# EAGLE design SystemControl (EAGLE 7.5.0)
CNAME: Homebrew SystemControl; CREVISION: 1.15; DESIGNER: Simon Hu
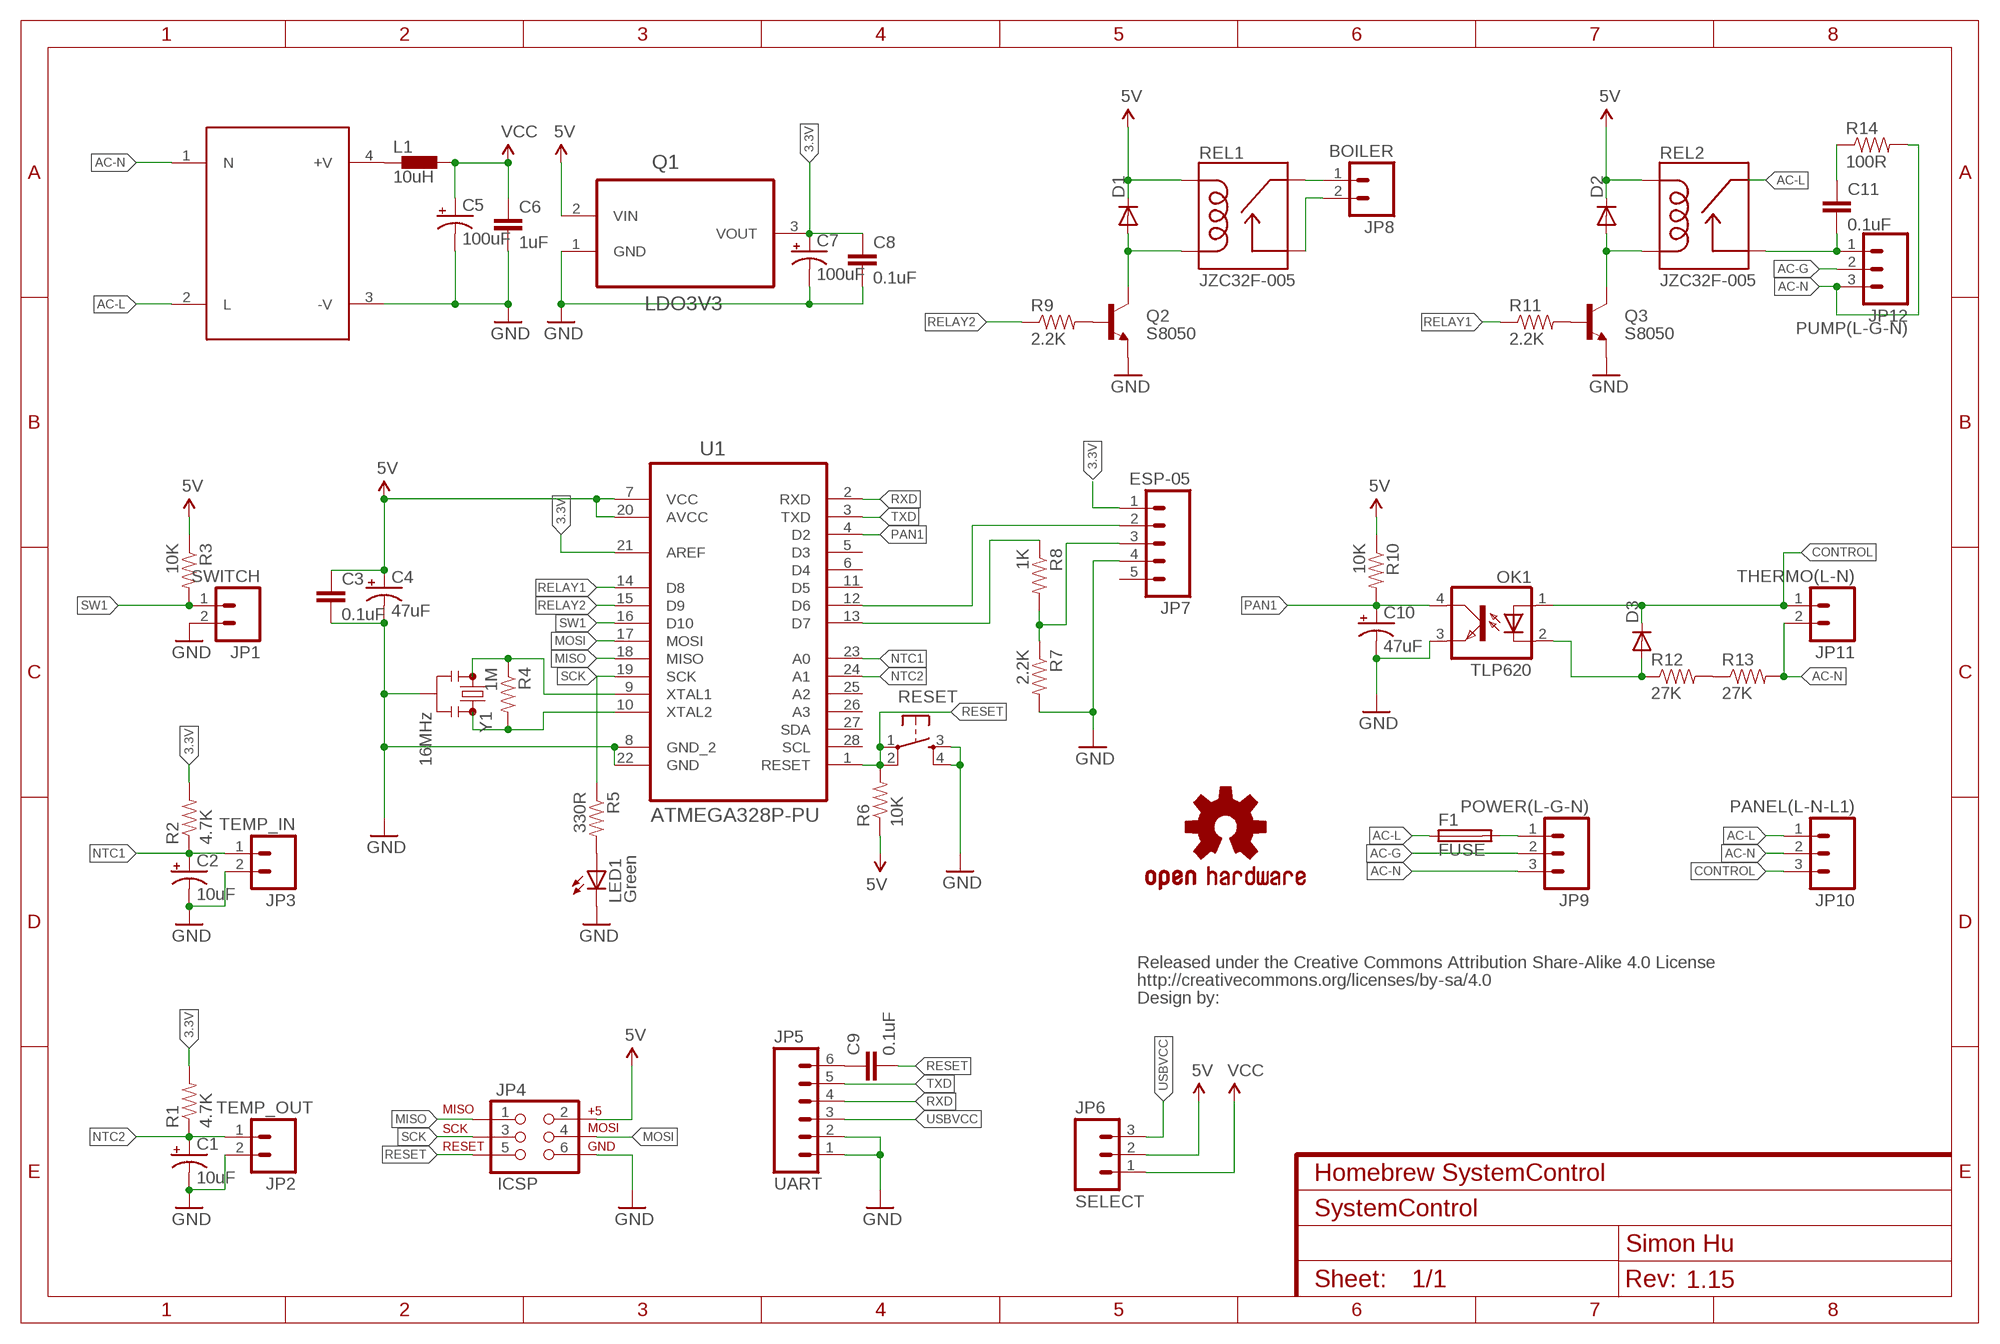
[diagram p0: schematic, sheet 1]

## Parts
C1  10uF  CAP_POLPTH2  [CPOL-RADIAL-10UF-25V]
C2  10uF  CAP_POLPTH2  [CPOL-RADIAL-10UF-25V]
C3  0.1uF  CAPPTH2  [CAP-PTH-SMALL2]
C4  47uF  CAP_POLPTH2  [CPOL-RADIAL-10UF-25V]
C5  100uF  CAP_POLPTH2  [CPOL-RADIAL-10UF-25V]
C6  1uF  CAPPTH2  [CAP-PTH-SMALL2]
C7  100uF  CAP_POLPTH2  [CPOL-RADIAL-10UF-25V]
C8  0.1uF  CAPPTH2  [CAP-PTH-SMALL2]
C9  0.1uF  CAPPTH2  [CAP-PTH-SMALL2]
C10  47uF  CAP_POLPTH2  [CPOL-RADIAL-10UF-25V]
C11  0.1uF  CAPPTH3  [CAP-PTH-LARGE]
CC_TEXT1  CREATIVE_COMMONS  [CREATIVE_COMMONS]
D1  1N4007  DIODEDO-1N4148  [DO-1N4148]
D2  1N4007  DIODEDO-1N4148  [DO-1N4148]
D3  1N4007  DIODEDO-1N4148  [DO-1N4148]
F1  FUSE  FUSESHK20L  [SHK20L]
IC1  NI-BOXING  [NI-BOXING]
JP1  SWITCH  M02LOCK  [1X02_LOCK]
JP2  TEMP_OUT  M02LOCK  [1X02_LOCK]
JP3  TEMP_IN  M02LOCK  [1X02_LOCK]
JP4  ICSP  AVR_SPI_PRG_6PTH  [2X3]
JP5  UART  M06LOCK  [1X06_LOCK]
JP6  SELECT  M03LOCK  [1X03_LOCK]
JP7  ESP-05  M05LOCK  [1X05_LOCK]
JP8  BOILER  M025MM  [SCREWTERMINAL-5MM-2]
JP9  POWER(L-G-N)  M03-SCREW-5MM  [SCREWTERMINAL-5MM-3]
JP10  PANEL(L-N-L1)  M03-SCREW-5MM  [SCREWTERMINAL-5MM-3]
JP11  THERMO(L-N)  M025MM  [SCREWTERMINAL-5MM-2]
JP12  PUMP(L-G-N)  M03-SCREW-5MM  [SCREWTERMINAL-5MM-3]
L1  10uH  BL01RN1A  [BL01RN1A]
LED1  Green  LED3MM  [LED3MM]
LOGO1  OSHW-LOGOL  [OSHW-LOGO-L]
OK1  TLP620  PC817  [DIL04]
Q1  LDO3V3  MCP1702-3302E/TO  [TO127P254X533-3]
Q2  S8050  TRANSISTOR_NPN2N3904  [TO-92]
Q3  S8050  TRANSISTOR_NPN2N3904  [TO-92]
R1  4.7K  RESISTORPTH-1/4W  [AXIAL-0.4]
R2  4.7K  RESISTORPTH-1/4W  [AXIAL-0.4]
R3  10K  RESISTORPTH-1/4W  [AXIAL-0.4]
R4  1M  RESISTORPTH-1/4W  [AXIAL-0.4]
R5  330R  RESISTORPTH-1/4W  [AXIAL-0.4]
R6  10K  RESISTORPTH-1/4W  [AXIAL-0.4]
R7  2.2K  RESISTORPTH-1/4W  [AXIAL-0.4]
R8  1K  RESISTORPTH-1/4W  [AXIAL-0.4]
R9  2.2K  RESISTORPTH-1/4W  [AXIAL-0.4]
R10  10K  RESISTORPTH-1/4W  [AXIAL-0.4]
R11  2.2K  RESISTORPTH-1/4W  [AXIAL-0.4]
R12  27K  RESISTORPTH-1W  [AXIAL-0.6]
R13  27K  RESISTORPTH-1W  [AXIAL-0.6]
R14  100R  RESISTORPTH-1W  [AXIAL-0.6]
REL1  JZC32F-005  RELAYPTH4  [RELAY-JZC]
REL2  JZC32F-005  RELAYPTH4  [RELAY-JZC]
RESET  TAC_SWITCHPTH  [TACTILE-PTH]
U1  ATMEGA328P-PU  [DIP254P762X457-28]
Y1  16MHz  RESONATORPTH  [RESONATOR-PTH]

## Nets
3.3V [POWER]: C7.1(+) C8.1 JP7.1 Q1.3(VOUT) R1.P$2 R2.P$2 U1.21(AREF)
5V [POWER]: C3.1 C4.1(+) D1.C D2.C JP4.2(VCC) JP6.2 Q1.2(VIN) R3.P$1 R6.P$1 R10.P$1 REL1.5(COIL1) REL2.5(COIL1) U1.7(VCC) U1.20(AVCC)
AC-G [AC]: JP9.2 JP12.2
AC-L [AC]: F1.1A IC1.2(L) JP10.1 REL2.4(MAIN)
AC-N [AC]: IC1.1(N) JP9.3 JP10.2 JP11.2 JP12.3 R13.P$2 R14.P$2
CONTROL [THERMO]: D3.C JP10.3 JP11.1 OK1.1(A)
GND [POWER]: C1.2(-) C2.2(-) C3.2 C4.2(-) C5.2(-) C6.2 C7.2(-) C8.2 C10.2(-) IC1.3(-V) JP1.2 JP2.2 JP3.2 JP4.6(GND) JP5.1(GND) JP5.2(EMPTY) JP7.4 LED1.K(C) OK1.3(EMIT) Q1.1(GND) Q2.1(E) Q3.1(E) R7.P$2 RESET.3 RESET.4 U1.8(GND_2) U1.22(GND) Y1.2
MISO: JP4.1(MISO) U1.18(MISO)
MOSI: JP4.4(MOSI) U1.17(MOSI)
N$1: C9.1 JP5.6(RESET)
N$2: R4.P$1 U1.9(XTAL1) Y1.1
N$3: R4.P$2 U1.10(XTAL2) Y1.3
N$4: Q3.2(B) R11.P$2
N$5: D2.A Q3.3(C) REL2.1(COIL2)
N$6: Q2.2(B) R9.P$2
N$7: D1.A Q2.3(C) REL1.1(COIL2)
N$8 [POWER]: JP8.1 REL1.4(MAIN)
N$9 [POWER]: JP8.2 REL1.3(NO)
N$10: LED1.A R5.P$2
N$11 [AC]: C11.2 JP12.1 REL2.3(NO)
N$12 [POWER]: IC1.4(+V) L1.1
N$13 [AC]: C11.1 R14.P$1
N$14: JP7.3 R7.P$1 R8.P$2
N$15 [AC]: F1.2A JP9.1
N$16 [THERMO]: R12.P$2 R13.P$1
N$17 [THERMO]: D3.A OK1.2(C) R12.P$1
N$18: JP7.2 U1.12(D6)
N$19: R8.P$1 U1.13(D7)
NTC1: C2.1(+) JP3.1 R2.P$1 U1.23(A0)
NTC2: C1.1(+) JP2.1 R1.P$1 U1.24(A1)
PAN1: C10.1(+) OK1.4(COL) R10.P$2 U1.4(D2)
RELAY1: R11.P$1 U1.14(D8)
RELAY2: R9.P$1 U1.15(D9)
RESET: C9.2 JP4.5(RESET) R6.P$2 RESET.1 RESET.2 U1.1(RESET)
RXD: JP5.4(RXD) U1.2(RXD)
SCK: JP4.3(SCK) R5.P$1 U1.19(SCK)
SW1: JP1.1 R3.P$2 U1.16(D10)
TXD: JP5.5(TXD) U1.3(TXD)
USBVCC [POWER]: JP5.3(VCC) JP6.3
VCC [POWER]: C5.1(+) C6.1 JP6.1 L1.2
Unconnected: JP7.5 U1.5(D3) U1.6(D4) U1.11(D5) U1.25(A2) U1.26(A3) U1.27(SDA) U1.28(SCL)

## Library data of the parts
C1 C2 C4 C5 C7 C10 = SparkFun-Capacitors:CAP_POL: Capacitor Polarized These are standard SMD and PTH capacitors. Normally 10uF, 47uF, and 100uF in electrolytic and tantalum varieties. Always verify the external diameter of the through hole cap, it varies with capacity, voltage, and manufacturer. The EIA devices should be standard.
C3 C6 C8 C9 = SparkFun-Capacitors:CAP: Capacitor Standard 0603 ceramic capacitor, and 0.1" leaded capacitor.
C11 = SparkFun-Passives:CAP: Capacitor Standard 0603 ceramic capacitor, and 0.1" leaded capacitor.
CC_TEXT1 = SparkFun-Retired:CREATIVE_COMMONS: Creative Commons License summary- RETIRED. Please use parts FRAME-LETTER/FRAME-LEDGER to add this to both schematic and board file.
D1-D3 = adafruit:DIODE: Diode SMADIODE - SMA Surface Mount Package 20V 1A Schottky Diode Digikey: 641-1014-6-ND DO-1N4148 - Through Hole Small Current Diode SOD-123 20V 1 A (.5mV Vf) Schottky Diode - Digikey: MBRX120TPMSCT-ND SOD-323 10V 570mA (.38mV Vf, 3ns) Schottky Diode - Digikey: ZLLS410CT-ND SOD-523 30V 30mA Schottky Diode (RB751S-40TE61) - Digikey: RB751S-40TE61CT-ND SOT23-R/W - SOT23 Package (R = Solder Paste/Reflow Ovens, W = Hand-Soldering) BAT54Film 40V 300mA - Digikey: 497-7162-1-ND
F1 = fuse:FUSE: Fuse; OC_FARNELL: unknown; OC_NEWARK: unknown
IC1 = Airfit:NI-BOXING: NI-BOXING POWER SUPLY
JP1-JP3 = SparkFun-Connectors:M02: Standard 2-pin 0.1" header. Use with - straight break away headers ( PRT-00116) - right angle break away headers (PRT-00553) - swiss pins (PRT-00743) - machine pins (PRT-00117) - female headers (PRT-00115) Molex polarized connector foot print use with: PRT-08233 with associated crimp pins and housings. 2.54_SCREWTERM for use with PRT-10571. 3.5mm Screw Terminal footprints for PRT-08084 5mm Screw Terminal footprints for use with PRT-08432
JP4 = SparkFun-Connectors:AVR_SPI_PRG_6: AVR ISP 6 Pin This is the reduced ISP connector for AVR programming. Common on Arduino. This footprint will take up less PCB space and can be used with a 10-pin to 6-pin adapter such as SKU: BOB-08508 **Special note about "TEST_POINT" package. The stop mask is on the top side, so if you want your programming test points to be on the bottom of your board, make sure to place this package on the bottom side of the board. This also ensure that the orientation to program from the bottom side will be correct.
JP5 = SparkFun-Connectors:M06: Header 6 Standard 6-pin 0.1" header. Use with straight break away headers (SKU : PRT-00116), right angle break away headers (PRT-00553), swiss pins (PRT-00743), machine pins (PRT-00117), and female headers (PRT-00115). Molex polarized connector foot print use with SKU : PRT-08094 with associated crimp pins and housings. NOTES ON THE VARIANTS LOCK and LOCK_LONGPADS... This footprint was designed to help hold the alignment of a through-hole component (i.e. 6-pin header) while soldering it into place. You may notice that each hole has been shifted either up or down by 0.005 of an inch from it's more standard position (which is a perfectly straight line). This slight alteration caused the pins (the squares in the middle) to touch the edges of the holes. Because they are alternating, it causes a "brace" to hold the component in place. 0.005 has proven to be the perfect amount of "off-center" position when using our standard breakaway headers. Although looks a little odd when you look at the bare footprint, once you have a header in there, the alteration is very hard to notice. Also,if you push a header all the way into place, it is covered up entirely on the bottom side. This idea of altering the position of holes to aid alignment will be further integrated into the Sparkfun Library for other footprints. It can help hold any component with 3 or more connection pins.
JP6 = SparkFun-Connectors:M03: Header 3 Standard 3-pin 0.1" header. Use with straight break away headers (SKU : PRT-00116), right angle break away headers (PRT-00553), swiss pins (PRT-00743), machine pins (PRT-00117), and female headers (PRT-00115). Molex polarized connector foot print use with SKU : PRT-08232 with associated crimp pins and housings.
JP7 = SparkFun-Connectors:M05: Header 5 Standard 5-pin 0.1" header. Use with straight break away headers (SKU : PRT-00116), right angle break away headers (PRT-00553), swiss pins (PRT-00743), machine pins (PRT-00117), and female headers (PRT-00115). Molex polarized connector foot print use with SKU : PRT-08230 with associated crimp pins and housings.
JP8 JP11 = SparkFun-Connectors:M02: Standard 2-pin 0.1" header. Use with - straight break away headers ( PRT-00116) - right angle break away headers (PRT-00553) - swiss pins (PRT-00743) - machine pins (PRT-00117) - female headers (PRT-00115) Molex polarized connector foot print use with: PRT-08233 with associated crimp pins and housings. 2.54_SCREWTERM for use with PRT-10571. 3.5mm Screw Terminal footprints for PRT-08084 5mm Screw Terminal footprints for use with PRT-08432; STOREFRONT_ID: PRT-08432
JP9 JP10 JP12 = SparkFun-Connectors:M03: Header 3 Standard 3-pin 0.1" header. Use with straight break away headers (SKU : PRT-00116), right angle break away headers (PRT-00553), swiss pins (PRT-00743), machine pins (PRT-00117), and female headers (PRT-00115). Molex polarized connector foot print use with SKU : PRT-08232 with associated crimp pins and housings.; STOREFRONT_ID: PRT-08433
L1 = inductors:BL0: Noise Suppression Products/EMI Suppression Filters, Lead EMIFIL(R) Inductor Type Source: http://www.murata.com .. BL01RN1_DS.pdf
LED1 = adafruit:LED: LED OSRAM: - CHIPLED LG R971, LG N971, LY N971, LG Q971, LY Q971, LO R971, LY R971 LH N974, LH R974 LS Q976, LO Q976, LY Q976 LO Q996 - Hyper CHIPLED LW Q18S LB Q993, LB Q99A, LB R99A - SideLED LS A670, LO A670, LY A670, LG A670, LP A670 LB A673, LV A673, LT A673, LW A673 LH A674 LY A675 LS A676, LA A676, LO A676, LY A676, LW A676 LS A679, LY A679, LG A679 - Hyper Micro SIDELED® LS Y876, LA Y876, LO Y876, LY Y876 LT Y87S - SmartLED LW L88C, LW L88S LB L89C, LB L89S, LG L890 LS L89K, LO L89K, LY L89K LS L896, LA L896, LO L896, LY L896 - TOPLED LS T670, LO T670, LY T670, LG T670, LP T670 LSG T670, LSP T670, LSY T670, LOP T670, LYG T670 LG T671, LOG T671, LSG T671 LB T673, LV T673, LT T673, LW T673 LH T674 LS T676, LA T676, LO T676, LY T676, LB T676, LH T676, LSB T676, LW T676 LB T67C, LV T67C, LT T67C, LS T67K, LO T67K, LY T67K, LW E67C LS E67B, LA E67B, LO E67B, LY E67B, LB E67C, LV E67C, LT E67C LW T67C LS T679, LY T679, LG T679 LS T770, LO T770, LY T770, LG T770, LP T770 LB T773, LV T773, LT T773, LW T773 LH T774 LS E675, LA E675, LY E675, LS T675 LS T776, LA T776, LO T776, LY T776, LB T776 LHGB T686 LT T68C, LB T68C - Hyper Mini TOPLED® LB M676 - Mini TOPLED Santana® LG M470 LS M47K, LO M47K, LY M47K Source: http://www.osram.convergy.de/
LOGO1 = SparkFun-Aesthetics:OSHW-LOGO: Open Source Hardware Logo This logo indicates the piece of hardware it is found on incorporates a OSHW license and/or adheres to the definition of open source hardware found here: http://freedomdefined.org/OSHW
OK1 = optocoupler:PC817: SHARP OPTO COUPLER; MPN: PC817X4J000F; OC_FARNELL: 9707727; OC_NEWARK: 97K7059
Q1 = Microchip_By_element14_Batch_1:MCP1702-3302E/TO: IC, V REG, LDO, 250MA; MPN: MCP1702-3302E/TO; OC_FARNELL: 1331485; OC_NEWARK: 34M7419; PACKAGE: TO-92; SUPPLIER: Microchip
Q2 Q3 = SparkFun-DiscreteSemi:TRANSISTOR_NPN: Generic NPN BJT MMBT2222A - TRANS-08049 (SOT-23, 1A 40V) MPSA42 - TRANS-09116 (SOT-23, 500mA 300V) MMBT5088LT1G - TRANS-11160 (SOT-23, 50 mA 30V) BC547 - COM-08928 <http://www.sparkfun.com/products/8928> (TO-92 45V 100mA) (1.Collector 2.Base 3.Emitter) 2N3904 - COM-00521 <http://www.sparkfun.com/products/521> (TO-92 40V 200mA) (1.Emitter 2.Base 3.Collector) P2N2222A - COM-12852 <http://www.sparkfun.com/products/12852> (TO-92 40V 600mA) (1.Collector 2.Base 3.Emitter); PROD_ID: TRANS-08447
R1-R11 = SparkFun-Passives:RESISTOR: Resistor Basic schematic elements and footprints for 0603, 1206, and PTH resistors.
R12-R14 = SparkFun-Resistors:RESISTOR: Resistor Basic schematic elements and footprints for 0603, 1206, and PTH resistors.
REL1 REL2 = Airfit:RELAY: SPDT relay (COM-00101)
RESET = SparkFun-Retired:TAC_SWITCH: Momentary Switch Button commonly used for reset or general input. Spark Fun Electronics SKU : COM-00097 SMT- SWCH-08247
U1 = Atmel_By_element14_Batch_1-00:ATMEGA328P-PU: 8-bit Microcontroller with In-System Programmable Flash; MPN: ATMEGA328P-PU; OC_FARNELL: 1715487; OC_NEWARK: 15R0268; PACKAGE: PDIP-28; SUPPLIER: Atmel
Y1 = SparkFun-FreqCtrl:RESONATOR: Resonator Small SMD resonator. Used, eg, on the Arduino Pro/ Pro Mini boards. 8MHz- XTAL-08895 16MHz- XTAL-08900

## Net classes
1 AC: width 2.032 mm, clearance 2.54 mm
2 THERMO: width 1.27 mm, clearance 1.27 mm
3 POWER: width 0.61 mm, clearance 0.406 mm

## Board
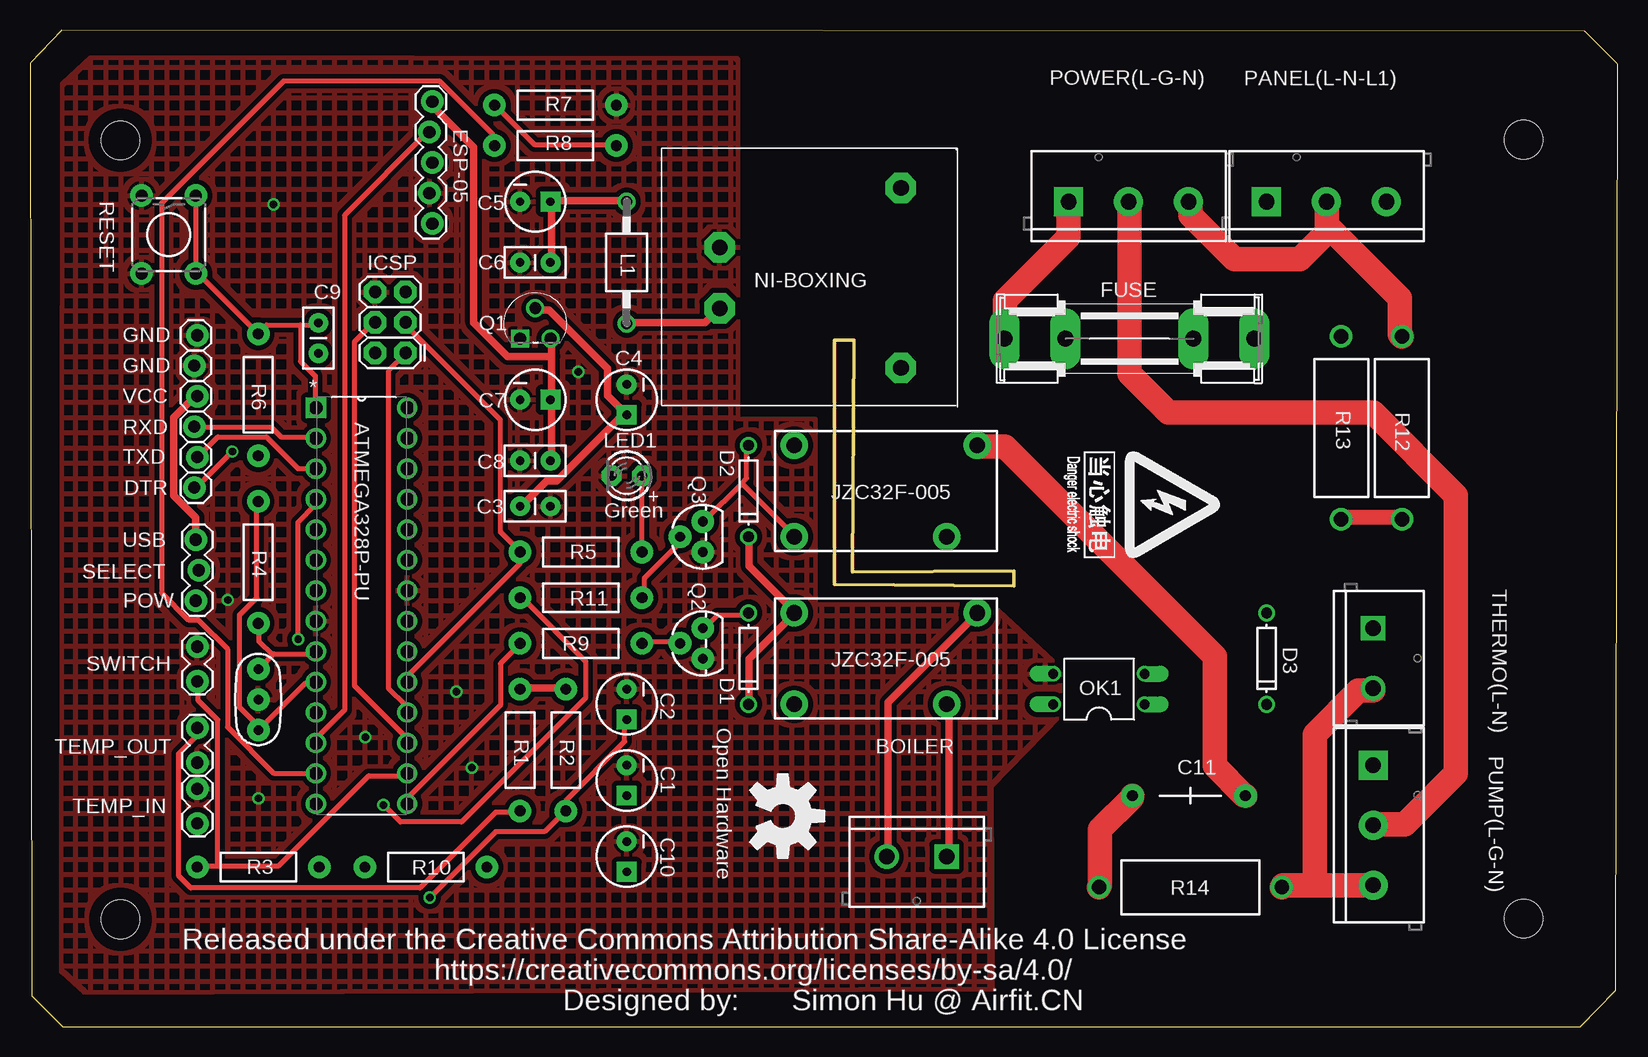
[diagram p1: board, top side]
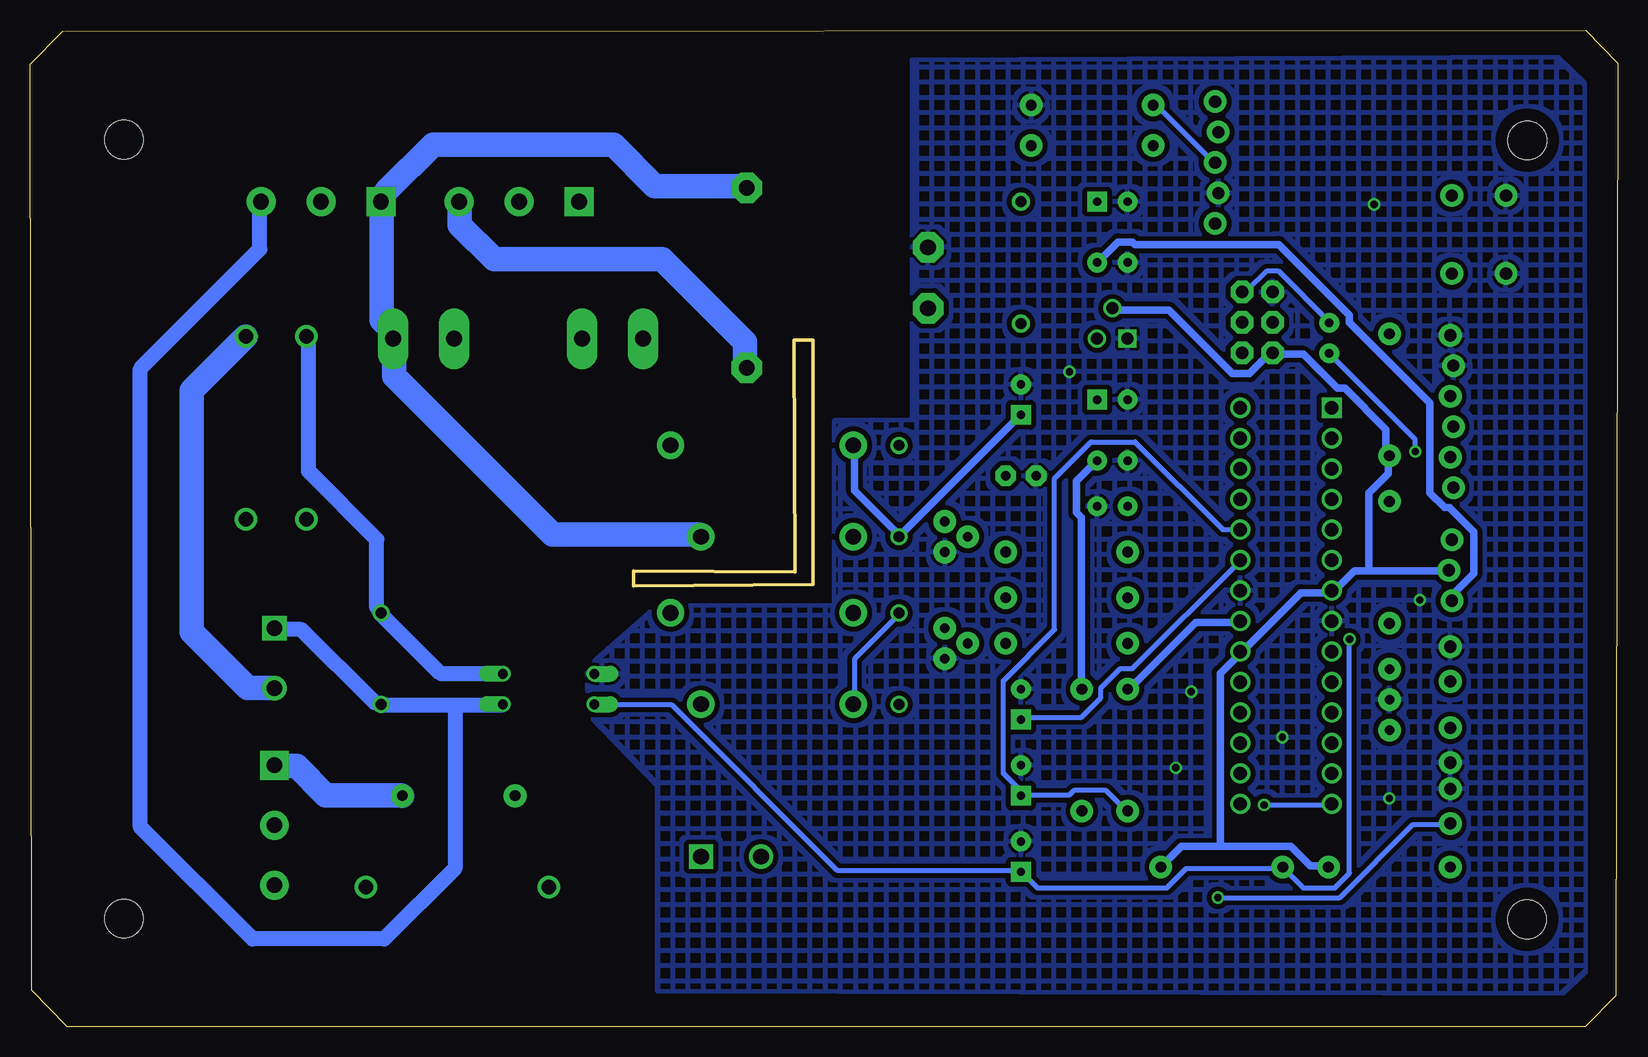
[diagram p2: board, bottom side, seen from below]

Size 132.34 x 83.1 mm. Coordinates in mm from the lower left corner, seen from the top.
Outline: 2.71,0 129.25,0 132.19,3.05 132.34,80.25 129.61,83 2.64,83.1 0,80.33 0.14,2.57 2.71,0
Copper layers (1*16): Top 0.035mm / dielectric 1.5mm / Bottom 0.035mm
Design rules "default *": minimum track width 16mil, minimum drill 24mil, track to track 16mil, track to pad 16mil, pad to pad 16mil, via to via 16mil, smd to smd 16mil, copper to edge 40mil, drill to drill 8mil, minimum pad ring 10mil, minimum via ring 8mil, stop-mask expansion 4mil, vias tented up to drill 0mil, thermal gap 10mil
Holes 3.2 mm at 7.53,73.91 7.55,8.96 124.51,73.95 124.51,9.02
Milling: area 67.1,36.7 to 82,57.3

### Footprints (pad centres in the part's own frame; a part is rotated, then mirrored left to right if it is on the bottom)
CPOL-RADIAL-10UF-25V = drill 0.7 pad 1.651 square: 1 1.27,0 | drill 0.7 pad 1.651: 2 -1.27,0
CAP-PTH-SMALL2 = drill 0.7 pad 1.651: 1 0,0; 2 2.54,0
CAP-PTH-LARGE = drill 0.9 pad 1.905: 1 -4.826,0; 2 4.572,0
DO-1N4148 = drill 0.9: A -3.81,0; C 3.81,0
SHK20L = drill 1.321 pad 2.54 long: 1A -10.414,0; 1B -5.334,0; 2A 10.414,0; 2B 5.334,0
NI-BOXING = drill 1.3 pad 2.54 octagon: 1 -7.62,7.493; 2 -7.62,-7.493; 3 7.493,-2.54; 4 7.493,2.54
1X02_LOCK = drill 1.016 pad 1.88: 1 -0.178,0; 2 2.718,0
2X3 = drill 1.016 pad 1.88 octagon: 1 0,0; 2 0,2.54; 3 2.54,0; 4 2.54,2.54; 5 5.08,0; 6 5.08,2.54
1X06_LOCK = drill 1.016 pad 1.88: 1 0,0; 2 2.54,-0.254; 3 5.08,0; 4 7.62,-0.254; 5 10.16,0; 6 12.7,-0.254
1X03_LOCK = drill 1.016 pad 1.88: 1 0,0.127; 2 2.54,-0.127; 3 5.08,0.127
1X05_LOCK = drill 1.016 pad 1.88: 1 0,0.127; 2 2.54,-0.127; 3 5.08,0.127; 4 7.62,-0.127; 5 10.16,0.127
SCREWTERMINAL-5MM-2 = drill 1.3 pad 2.032 square: 1 0,0 | drill 1.3 pad 2.032: 2 5,0
SCREWTERMINAL-5MM-3 = drill 1.3 pad 2.413 square: 1 0,0 | drill 1.3 pad 2.413: 2 5,0; 3 10,0
BL01RN1A = drill 0.9 pad 1.5: 1 -5.08,0; 2 5.08,0
LED3MM = drill 0.813 pad 1.676 octagon: A -1.27,0; K 1.27,0
DIL04 = drill 0.813 offset: 1 -1.27,-3.81; 2 1.27,-3.81; 3 1.27,3.81; 4 -1.27,3.81
TO127P254X533-3 = drill 0.991 square: 1 -2.54,-2.54 | drill 0.991: 2 -1.27,0; 3 0,-2.54
TO-92 = drill 0.813 pad 1.88: 1 -1.27,0; 2 0,1.905; 3 1.27,0
AXIAL-0.4 = drill 0.9 pad 1.88: P$1 -5.08,0; P$2 5.08,0
AXIAL-0.6 = drill 1.2 pad 1.88: P$1 -7.62,0; P$2 7.62,0
RELAY-JZC = drill 1.3 pad 2.286: 1 3.81,-8.89; 3 -3.81,6.35; 4 3.81,3.81; 5 -3.81,-8.89
TACTILE-PTH = drill 1.016 pad 1.88: 1 -3.251,2.261; 2 3.251,2.261; 3 -3.251,-2.261; 4 3.251,-2.261
DIP254P762X457-28 = drill 1.118 square: 1 -7.62,33.02 | drill 1.118: 2 -7.62,30.48; 3 -7.62,27.94; 4 -7.62,25.4; 5 -7.62,22.86; 6 -7.62,20.32; 7 -7.62,17.78; 8 -7.62,15.24; 9 -7.62,12.7; 10 -7.62,10.16; 11 -7.62,7.62; 12 -7.62,5.08; 13 -7.62,2.54; 14 -7.62,0; 15 0,0; 16 0,2.54; 17 0,5.08; 18 0,7.62; 19 0,10.16; 20 0,12.7; 21 0,15.24; 22 0,17.78; 23 0,20.32; 24 0,22.86; 25 0,25.4; 26 0,27.94; 27 0,30.48; 28 0,33.02
RESONATOR-PTH = drill 0.8 pad 1.88: 1 -2.54,0; 2 0,0; 3 2.54,0

### Placement (x,y rotation side)
C1  49.74,20.53 270 top
C2  49.74,26.88 270 top
C3  40.85,43.39 0 top
C4  49.74,52.28 270 top
C5  42.12,68.79 0 top
C6  43.39,63.71 180 top
C7  42.12,52.28 0 top
C8  43.39,47.2 180 top
C9  24.04,56.14 90 top
C10  49.74,14.18 270 top
C11  96.73,19.26 0 top
CC_TEXT1  32.98,1.35 0 top
D1  59.9,30.69 270 top
D2  59.9,44.66 270 top
D3  103.08,30.69 270 top
F1  91.65,57.36 180 top
IC1  64.98,62.44 180 top
JP1  13.95,28.97 90 top
JP2  13.95,24.74 270 top
JP3  13.95,17.12 90 top
JP4  31.31,56.18 90 top
JP5  13.95,57.65 270 top
JP6  13.95,35.52 90 top
JP7  33.42,77.13 270 top
JP8  76.41,14.18 180 top
JP9  86.57,68.79 0 top
JP10  103.08,68.79 0 top
JP11  111.97,33.23 270 top
JP12  111.97,21.8 270 top
L1  49.74,63.71 90 top
LED1  49.74,45.93 180 top
LOGO1  62.76,17.57 270 top
OK1  89.11,28.15 90 top
Q1  43.39,59.9 0 top
Q2  56.09,31.96 90 top
Q3  56.09,40.85 90 top
R1  40.85,23.07 90 top
R2  44.66,23.07 90 top
R3  19.03,13.31 180 top
R4  19.03,38.71 90 top
R5  45.93,39.58 0 top
R6  19.03,52.68 90 top
R7  43.8,76.84 0 top
R8  43.8,73.47 0 top
R9  45.93,31.96 0 top
R10  33,13.31 180 top
R11  45.93,35.77 0 top
R12  109.29,49.93 270 top
R13  114.36,49.93 90 top
R14  96.73,11.64 0 top
REL1  72.6,30.69 270 top
REL2  72.6,44.66 270 top
RESET  11.56,66.05 270 top
U1  31.45,18.58 0 top
Y1  19.03,27.28 270 top

### Tracks (layer width: path | path; a pad name or v marks a point on that pad's centre or on a via)
3.3V
  Top 0.61: R2.P$2 44.5,28.24 41.05,28.24 R1.P$2 | 43.48,55.88 43.48,52.42 C7.1 43.48,52.02 43.48,47.34 C8.1 | 43.48,55.88 43.48,57.3 Q1.3 | 43.48,55.88 39.83,55.88 36.98,58.72 36.98,73.35 33.73,76.6 33.73,77.01 JP7.1
  Bottom 0.61: U1.21 31.5,33.73 35.15,33.73 40.84,28.04 R1.P$2 | R2.P$2 44.7,28.24 44.7,42.47 45.11,42.87 45.11,45.51 43.48,47.14 C8.1
5V
  Top 0.61: Q1.2 42.27,59.74 43.28,59.74 48.16,54.86 48.16,52.63 49.58,51.2 C4.1 49.38,51 43.89,45.51 43.08,45.51 41.05,43.48 C3.1 | D1.C 59.94,27.02 59.94,30.68 63.6,34.34 REL1.5 63.6,34.74 59.94,38.4 59.94,40.84 D2.C
  Bottom 0.61: REL2.5 63.6,48.36 63.6,44.7 59.94,41.04 D2.C 59.74,41.04 49.78,51 C4.1 | 33.12,15.03 36.37,15.03 38,13.41 R10.P$1 | 33.12,15.03 27.23,15.03 25.6,13.41 24.18,13.41 R3.P$1 | 20.73,38 21.95,38 23.57,36.37 U1.7 23.98,36.17 26.42,36.17 31.29,31.29 U1.20 31.5,31.09 33.12,29.46 33.12,15.03 | 20.73,38 14.22,38 JP6.2 | 20.73,38 20.73,44.5 19.1,46.12 19.1,47.55 R6.P$1 19.3,47.75 19.3,49.78 22.76,53.24 23.37,53.24 26.21,56.08 28.65,56.08 JP4.2 29.06,56.08 30.68,54.46 32.11,54.46 37.39,59.74 42.06,59.74 Q1.2
AC-G
  Top 2.032: JP12.2 112.17,16.86 114.61,16.86 118.87,21.13 118.87,44.3 111.96,51.2 94.89,51.2 91.64,54.46 91.64,68.68 JP9.2
AC-L
  Bottom 2.032: REL2.4 76.61,41.04 88.8,41.04 102.01,54.25 102.01,57.3 F1.1A 102.41,58.32 103.02,58.93 103.02,68.68 JP10.1 102.62,69.7 98.75,73.56 83.72,73.56 80.26,70.1 72.75,70.1 IC1.2
AC-N
  Top 2.032: 107.09,11.78 111.96,11.78 JP12.3 | 107.09,11.78 104.44,11.78 R14.P$2 | 107.09,11.78 107.09,24.38 110.74,28.04 111.96,28.04 JP11.2 | 108.41,66.55 108.1,66.85 108.1,68.68 JP10.2 | 108.41,66.55 114.2,60.75 114.2,57.71 R13.P$2 | 108.41,66.55 105.87,64.01 100.38,64.01 96.72,67.66 96.72,68.68 JP9.3
  Bottom 2.032: IC1.1 72.75,55.06 72.75,57.1 79.65,64.01 93.67,64.01 96.52,66.85 96.52,68.68 JP9.3 | JP11.2 112.17,28.24 114.2,28.24 118.87,32.92 118.87,53.03 114.4,57.5 R13.P$2
CONTROL
  Bottom 1.27: 96.93,26.82 103.02,26.82 D3.C 103.63,27.02 109.73,33.12 111.96,33.12 JP11.1 | 96.93,26.82 93.07,26.82 OK1.1 | 96.93,26.82 96.93,13.21 102.82,7.31 113.79,7.31 123.14,16.66 123.14,54.86 113.18,64.82 113.18,68.68 JP10.3
GND  (via drill 0.61)
  other vias: 20.3,68.56 19.03,19.05 35.54,27.93 36.84,21.59 45.7,54.6 27.95,24.14 16.49,35.58
  pour Bottom (hatched): 4.98,80.85 58.83,80.6 58.83,50.53 65.32,50.53 65.32,35.08 80.06,35.08 85.91,29.96 85.86,26.07 80.09,20.1 80.06,2.98 4.57,2.77 2.64,4.57 2.73,78.65
  pour Top (hatched): 5.04,80.83 58.96,80.74 58.96,50.67 65.46,50.67 65.46,35.22 80.19,35.22 85.82,30.02 85.82,25.92 80.09,20.04 80.19,3.12 4.56,2.83 2.64,4.57 2.73,78.65
MISO
  Top 0.406: U1.18 31.29,26.21 31.29,26.82 29.87,28.24 29.87,54.66 31.29,56.08 JP4.1
MOSI
  Top 0.406: U1.17 31.29,23.77 31.29,24.18 27.03,28.45 27.03,57.1 28.65,58.72 JP4.4
N$1  (via drill 0.61)
  Top 0.406: v16.87,47.95 13.82,44.9 JP5.6
  Bottom 0.406: v16.87,47.95 16.87,48.97 23.98,56.08 C9.1
N$2
  Top 0.406: 20.22,30.99 19.1,29.87 Y1.1 | 20.22,30.99 20.32,31.09 23.77,31.09 U1.9 | 20.22,30.99 19.1,32.1 19.1,33.53 R4.P$1
N$3
  Top 0.406: U1.10 23.77,28.65 22.96,28.65 19.1,24.79 Y1.3 19.1,24.99 17.48,26.62 17.48,34.34 18.9,35.76 18.9,43.69 R4.P$2
N$4
  Top 0.406: R11.P$2 51.21,35.96 51.21,37.39 54.05,40.23 54.05,40.84 Q3.2
N$5
  Top 0.406: 59.33,45.31 56.29,42.26 Q3.3 | 59.33,45.31 59.74,45.72 59.74,48.36 D2.A | 59.33,45.31 63.6,41.04 REL2.1
N$6
  Top 0.406: R9.P$2 51.21,32.1 54.05,32.1 Q2.2
N$7
  Top 0.406: D1.A 59.74,34.34 57.3,34.34 56.29,33.32 Q2.3
  Bottom 0.406: REL1.1 63.6,27.02 63.6,30.68 59.94,34.34 D1.A
N$8
  Top 0.61: JP8.1 76.61,14.22 76.61,26.82 REL1.4
N$9
  Top 0.61: JP8.2 71.53,14.22 71.53,27.02 78.84,34.34 REL1.3
N$10
  Top 0.406: LED1.A 51,45.92 51,39.62 R5.P$2
N$11
  Top 2.032: REL2.3 79.05,48.36 81.28,48.36 98.75,30.88 98.75,21.74 101.19,19.3 C11.2
  Bottom 2.032: C11.2 101.4,19.3 107.7,19.3 110.13,21.74 111.96,21.74 JP12.1
N$12
  Top 0.61: L1.1 49.78,58.72 56.29,58.72 57.3,59.74 IC1.4
N$13
  Top 2.032: R14.P$1 89.2,11.78 89.2,16.46 91.85,19.1 C11.1
N$14
  Top 0.406: R8.P$2 48.77,73.56 42.06,73.56 38.81,76.81 R7.P$1
  Bottom 0.406: JP7.3 33.73,72.13 38.61,77.01 R7.P$1
N$15
  Top 2.032: JP9.1 86.56,68.68 86.56,65.83 81.28,60.55 81.28,57.5 F1.2A
N$16
  Top 1.27: R12.P$2 109.32,42.47 114.2,42.47 R13.P$1
N$17
  Bottom 1.27: OK1.2 93.07,29.46 98.15,29.46 103.02,34.34 D3.A 103.43,34.95 103.43,40.64 109.12,46.33 109.12,57.5 R12.P$1
N$18
  Top 0.406: U1.12 23.98,23.77 23.98,24.18 26.21,26.41 26.21,67.66 33.12,74.57 JP7.2
N$19
  Top 0.406: U1.13 23.77,21.13 20.32,21.13 16.46,24.99 16.46,31.49 14.02,33.93 13.21,33.93 10.97,36.17 10.97,68.68 21.13,78.84 34.14,78.84 38.61,74.37 38.61,73.56 R8.P$1
NTC1  (via drill 0.61)
  Top 0.406: C2.1 49.58,25.6 49.58,23.77 44.7,18.9 44.7,18.08 R2.P$1 44.5,17.88 42.88,16.25 38.81,16.25 v33.33,10.77
  Bottom 0.406: U1.23 31.5,38.81 40.44,29.87 41.45,29.87 43.08,28.24 43.08,27.43 44.7,25.8 49.58,25.8 C2.1 | v33.33,10.77 23.16,10.77 17.07,16.86 14.02,16.86 JP3.1
NTC2
  Top 0.406: JP2.1 13.82,24.79 13.82,24.18 12.39,22.76 12.39,12.6 13.41,11.58 32.51,11.58 38.81,17.88 40.84,17.88 R1.P$1
  Bottom 0.406: R1.P$1 41.05,18.08 42.67,19.71 45.31,19.71 45.72,19.3 49.58,19.3 C1.1 49.58,19.5 51.21,21.13 51.21,28.85 46.94,33.12 46.94,45.72 43.89,48.77 40.23,48.77 32.92,41.45 31.5,41.45 U1.24
PAN1  (via drill 0.61)
  Top 0.406: v22.35,32.31 22.35,42.06 23.77,43.48 23.77,43.89 U1.4
  Bottom 0.406: v22.35,32.31 22.35,12.8 23.57,11.58 26.21,11.58 27.84,13.21 R10.P$2 28.04,13.21 35.97,13.21 37.59,11.58 48.36,11.58 49.58,12.8 C10.1 49.78,13 65.02,13 78.84,26.82 85.14,26.82 OK1.4
RELAY1  (via drill 0.61)
  Top 0.406: v29.46,18.49 30.89,17.07 35.97,17.07 46.33,27.43 46.33,30.48 41.05,35.76 R11.P$1
  Bottom 0.406: v29.46,18.49 23.98,18.49 U1.14
RELAY2
  Top 0.406: U1.15 31.5,18.69 31.5,19.1 39.22,26.82 39.22,30.27 40.84,31.9 R9.P$1
RESET
  Top 0.406: RESET.1 13.82,69.29 13.82,62.99 RESET.2 14.02,62.79 18.9,57.91 R6.P$2 19.1,57.91 19.71,58.52 22.55,58.52 | 22.55,58.52 23.98,58.52 C9.2 | 22.55,58.52 22.55,55.47 23.77,54.25 23.77,51.61 U1.1
  Bottom 0.406: JP4.5 31.29,61.36 30.89,61.36 29.26,62.99 28.25,62.99 23.98,58.72 C9.2
RXD
  Top 0.406: U1.2 23.77,49.17 20.93,49.17 20.12,49.98 13.82,49.98 JP5.4
SCK
  Top 0.406: U1.19 31.5,28.85 31.5,29.26 40.84,38.61 40.84,39.42 R5.P$1 40.84,39.62 39.22,41.25 39.22,50.59 31.5,58.32 31.5,58.72 JP4.3
SW1
  Top 0.406: 15.65,13.41 14.02,13.41 R3.P$2 | 15.65,13.41 20.73,13.41 28.25,20.93 31.29,20.93 U1.16 | 15.65,13.41 15.65,25.6 14.02,27.23 14.02,28.65 JP1.1
TXD
  Top 0.406: U1.3 23.77,46.53 22.35,46.53 19.71,49.17 15.65,49.17 14.02,47.55 JP5.5
USBVCC
  Top 0.61: JP6.3 13.82,40.64 13.82,42.47 11.99,44.3 11.99,50.8 13.82,52.63 JP5.3
VCC
  Top 0.61: L1.2 49.58,68.88 43.48,68.88 C5.1 43.48,68.68 43.48,63.8 C6.1
  Bottom 0.61: JP6.1 13.82,35.56 13.82,35.96 11.99,37.79 11.99,41.25 14.02,43.28 14.43,43.28 15.65,44.5 15.65,52.02 22.35,58.72 22.35,59.33 28.25,65.22 40.23,65.22 40.44,65.43 41.66,65.43 43.28,63.8 C6.1

### Text on the board
tPlace: NI-BOXING | GND | GND | VCC | RXD | TXD | DTR | USB | POW | Open Hardware | Simon Hu @ Airfit.CN